# Altium schematic sheet Bier_kuehler.SchDoc: Bierkühler
size A4; Date: <Erstelldatum>; DrawnBy: Nico Herger / Thomas Arnold; Organization: HSLU T&A; Address1: Abteilung Elektrotechnik; Address2: Technikumsstrasse 21; Address3: CH-6048 Horw; Revision: V1.0; SheetNumber: 1; SheetTotal: 1; Projektname: Projekt Bier
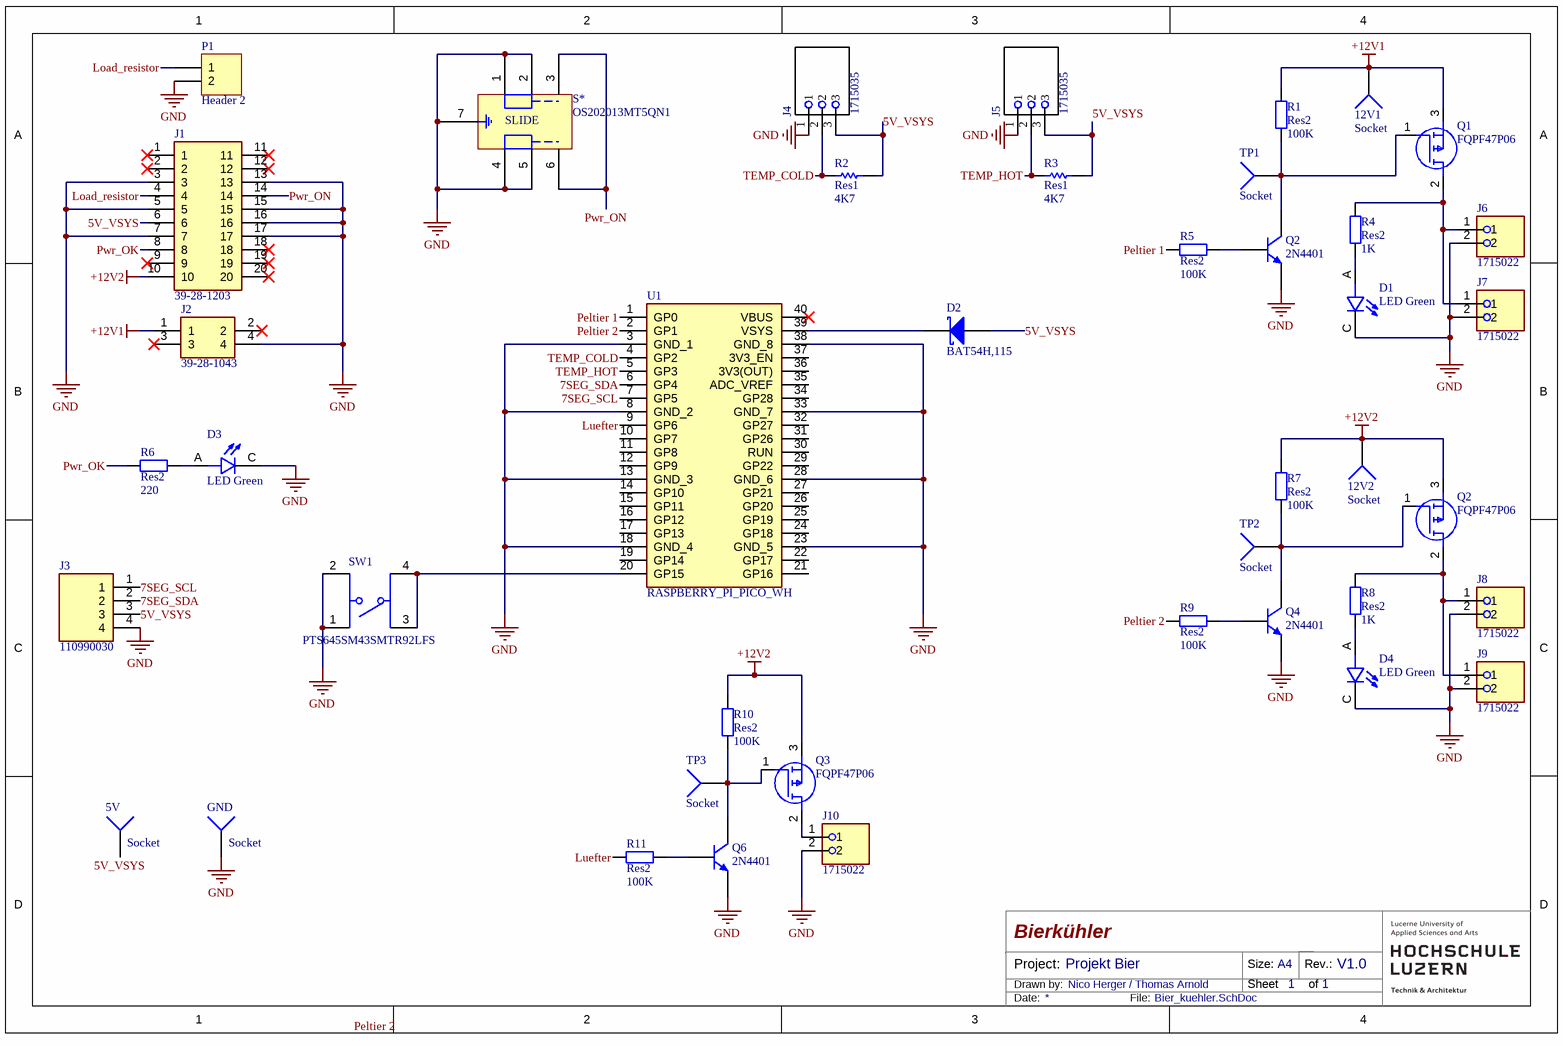
[diagram p0: Bier_kuehler.SchDoc]

## Parts
(Parts that share a designator on the sheet are numbered #1, #2 ... from top to bottom, then left to right.)
5V  Socket  [PIN1]
12V1  Socket  [PIN1]
12V2  Socket  [PIN1]
D1  LED Green  [1411_LED]
D2  BAT54H,115  [SOD-123F]
D3  LED Green  [1411_LED]
D4  LED Green  [1411_LED]
GND  Socket  [PIN1]
J1  39-28-1203  [39-28-1203]
J2  39-28-1043  [39-28-1043]
J3  110990030  [SEEED_110990030]
J4  1715035  [PHOENIX_1715035]
J5  1715035  [PHOENIX_1715035]
J6  1715022  [PHOENIX_1715022]
J7  1715022  [PHOENIX_1715022]
J8  1715022  [PHOENIX_1715022]
J9  1715022  [PHOENIX_1715022]
J10  1715022  [PHOENIX_1715022]
P1  Header 2  [HDR1X2]
Q1  FQPF47P06  [TO254P490X1016X1990-3P]
Q2#1  2N4401  [TO-92A]
Q2#2  FQPF47P06  [TO254P490X1016X1990-3P]
Q3  FQPF47P06  [TO254P490X1016X1990-3P]
Q4  2N4401  [TO-92A]
Q6  2N4401  [TO-92A]
R1  Res2  value 100K  [AXIAL-0.4]
R2  Res1  value 4K7  [AXIAL-0.3]
R3  Res1  value 4K7  [AXIAL-0.3]
R4  Res2  value 1K  [AXIAL-0.4]
R5  Res2  value 100K  [AXIAL-0.4]
R6  Res2  value 220  [AXIAL-0.4]
R7  Res2  value 100K  [AXIAL-0.4]
R8  Res2  value 1K  [AXIAL-0.4]
R9  Res2  value 100K  [AXIAL-0.4]
R10  Res2  value 100K  [AXIAL-0.4]
R11  Res2  value 100K  [AXIAL-0.4]
S*  OS202013MT5QN1  [OS202013MT5QN1]
SW1  PTS645SM43SMTR92LFS  [SWITCH_43SMTR92LFS]
TP1  Socket  [PIN1]
TP2  Socket  [PIN1]
TP3  Socket  [PIN1]
U1  RASPBERRY_PI_PICO_WH  [RASPBERRYPIPICOWH]

## Nets
+12V1: 12V1.1 J2.1 Q1.3(S) R1.2
+12V2: 12V2.1 J1.10 Q2#2.3(S) Q3.3(S) R7.2 R10.2
GND: D1.C D3.C D4.C GND.1 J1.3 J1.5 J1.7 J1.13 J1.15 J1.16 J1.17 J2.4 J3.4 J4.1 J5.1 J6.2 J7.2 J8.2 J9.2 J10.2 P1.2 Q2#1.1(E) Q4.1(E) Q6.1(E) S*.1 S*.2 S*.4 S*.5 S*.7 SW1.1 SW1.2 U1.3(GND_1) U1.8(GND_2) U1.13(GND_3) U1.18(GND_4) U1.23(GND_5) U1.28(GND_6) U1.33(GND_7) U1.38(GND_8)
5V_VSYS: 5V.1 D2.2(A) J1.6 J3.3 J4.3 J5.3 R2.1 R3.1
7SEG_SCL: J3.1 U1.7(GP5)
7SEG_SDA: J3.2 U1.6(GP4)
Load_resistor: J1.4 P1.1
Luefter: R11.1 U1.9(GP6)
Peltier 1: R5.2 U1.1(GP0)
Peltier 2: R9.2 U1.2(GP1)
Pwr_OK: J1.8 R6.1
Pwr_ON: J1.14 S*.3 S*.6
TEMP_COLD: J4.2 R2.2 U1.4(GP2)
TEMP_HOT: J5.2 R3.2 U1.5(GP3)
NetD1_A: D1.A R4.1
NetD2_1: D2.1(K) U1.39(VSYS)
NetD3_A: D3.A R6.2
NetD4_A: D4.A R8.1
NetJ6_1: J6.1 J7.1 Q1.2(D) R4.2
NetJ8_1: J8.1 J9.1 Q2#2.2(D) R8.2
NetJ10_1: J10.1 Q3.2(D)
NetQ1_1: Q1.1(G) Q2#1.3(C) R1.1 TP1.1
NetQ2#1_2: Q2#1.2(B) R5.1
NetQ2#2_1: Q2#2.1(G) Q4.3(C) R7.1 TP2.1
NetQ3_1: Q3.1(G) Q6.3(C) R10.1 TP3.1
NetQ4_2: Q4.2(B) R9.1
NetQ6_2: Q6.2(B) R11.2
NetSW1_3: SW1.3 SW1.4 U1.20(GP15)

Not connected (* = marked no-connect by the designer): J1 1* 2* 9* 11* 12* 18* 19* 20*; J2 2* 3*; U1 10(GP7) 11(GP8) 12(GP9) 14(GP10) 15(GP11) 16(GP12) 17(GP13) 19(GP14) 21(GP16) 22(GP17) 24(GP18) 25(GP19) 26(GP20) 27(GP21) 29(GP22) 30(RUN) 31(GP26) 32(GP27) 34(GP28) 35(ADC_VREF) 36(3V3(OUT)) 37(3V3_EN) 40(VBUS)*

## Notes on the sheet
- Labels drawn without touching a wire or pin: Peltier 2
- Project:
- Drawn by:
- Size:
- Sheet
- A4
- Rev.:
- of
- Date:
- File:
- (in symbol OS202013MT5QN1) SLIDE

## Library data of the parts
D1 D3 D4 = 150141GS73100: Green 525nm LED Indication - Discrete 3.1V 1411 (3528 Metric); Mouser Part Number: 710-150141GS73100; Datasheet: https://www.mouser.ch/datasheet/2/445/150141GS73100-1715081.pdf
D2 = BAT54H,115: D SCHOTTKY 30V 200MA; Mouser Number: 771-BAT54H-T/R; Datasheet: https://www.mouser.ch/datasheet/2/916/BAT54H-1598132.pdf
J1 = 39-28-1203: Connector; Manufacturer_Name: Molex; Datasheet Link: https://www.molex.com/pdm_docs/sd/039281023_sd.pdf; Height: 12.8mm; Manufacturer_Part_Number: 39-28-1203; Mouser Part Number: 538-39-28-1203; Mouser Price/Stock: https://www.mouser.co.uk/ProductDetail/Molex/39-28-1203?qs=4XSMV6Twtb2DRME9sVHqvA%3D%3D
J2 = 39-28-1043: Connector; Manufacturer_Name: Molex; Datasheet Link: https://www.molex.com/pdm_docs/sd/039281023_sd.pdf; Height: 12.8mm; Manufacturer_Part_Number: 39-28-1043; Mouser Part Number: 538-39-28-1043; Mouser Price/Stock: https://www.mouser.co.uk/ProductDetail/Molex/39-28-1043?qs=LQQHZ4xw2XCMHoV0KRLGhg%3D%3D; Arrow Part Number: 39-28-1043; Arrow Price/Stock: https://www.arrow.com/en/products/39-28-1043/molex?region=nac
J3 = 110990030: GROVE 2MM 4PIN VERT CONN 10PCS; MF: Seeed Technology; Arrow_Electronics-Purchase-URL: https://snapeda.com/shop?store=Arrow+Electronics&id=583576; Availability: Good; Package: None; Price: None; Mouser-Purchase-URL: https://snapeda.com/shop?store=Mouser&id=583576; MP: 110990030; SnapEDA_Link: https://www.snapeda.com/parts/110990030/Seeed%20Technology%20Co.,%20Ltd/view-part/583576/?ref=snap; Value: *
J6-J10 = 1715022: PCB Terminal Screw 5mm 16AWG 400V 17.5A 2 Position COMBICON MKDS Series | Phoenix Contact 1715022; SnapEDA_Link: https://www.snapeda.com/parts/1715022/Phoenix+Contact/view-part/?ref=snap; Package: None; Value: *; MF: Phoenix Contact; MP: 1715022; Check_prices: https://www.snapeda.com/parts/1715022/Phoenix+Contact/view-part/?ref=eda
P1 = Header 2: Header, 2-Pin; LatestRevisionDate: 17-Jul-2002; LatestRevisionNote: Re-released for DXP Platform.; Publisher: Altium Limited
Q1 Q2#2 Q3 = FQPF47P06: MOSFET (P-Channel); Manufacturer_Name: onsemi; Datasheet Link: https://www.onsemi.com/pdf/datasheet/fqpf47p06-d.pdf; Height: 4.9mm; Manufacturer_Part_Number: FQPF47P06; Mouser Part Number: 512-FQPF47P06; Mouser Price/Stock: https://www.mouser.co.uk/ProductDetail/ON-Semiconductor-Fairchild/FQPF47P06/?qs=Ra3DxqLXWjfTqaAPd3%2FiZw%3D%3D; Arrow Part Number: FQPF47P06; Arrow Price/Stock: https://www.arrow.com/en/products/fqpf47p06/on-semiconductor
Q2#1 Q4 Q6 = 2N3904: NPN General Purpose Amplifier; Published: 8-Jun-2000; LatestRevisionDate: 15-Jan-2003; LatestRevisionNote: PCB Footprint 'BCY-W3/D4.7' replaced; DatasheetVersion: 1997; PackageVersion: Sep-1998; PackageReference: TO-92A; Publisher: Altium Limited; PackageDescription: TO, Flat Index; 3 In-Line, Axial Leads; Body Dia. 4.5mm; Leads 0.51 x 0.48 mm (max); ComponentLink1Description: Manufacturer Link; ComponentLink1URL: http://www.fairchildsemi.com/; ComponentLink2Description: Datasheet; ComponentLink2URL: http://www.fairchildsemi.com/ds/2N%2F2N3904.pdf
R1 R4-R11 = Res2: Resistor; Published: 8-Jun-2000; LatestRevisionDate: 17-Jul-2002; LatestRevisionNote: Re-released for DXP Platform.; PackageReference: AXIAL-0.4; Publisher: Altium Limited; PackageDescription: Axial Device, Thru-Hole; 2 Leads; 0.4 in Pin Spacing
R2 R3 = Res1: Resistor; Published: 8-Jun-2000; LatestRevisionDate: 17-Jul-2002; LatestRevisionNote: Re-released for DXP Platform.; PackageReference: AXIAL-0.3; Publisher: Altium Limited; PackageDescription: Axial Device, Thru-Hole; 2 Leads; 0.3 in Pin Spacing
S* = OS202013MT5QN1: Slide Switch
SW1 = PTS645SM43SMTR92LFS: Tactile Switch Normally Open; Datasheet: https://www.mouser.ch/datasheet/2/60/pts645-1841767.pdf; Mouser Part Number: 611-PTS645SM43SMTR92
U1 = RASPBERRY_PI_PICO_WH: Undefined or Miscellaneous; Manufacturer_Name: RASPBERRY-PI; Manufacturer_Part_Number: RASPBERRY PI PICO WH; Datasheet Link: https://datasheets.raspberrypi.com/picow/pico-w-datasheet.pdf; Height: 4mm
5V 12V1 12V2 GND TP1-TP3 = Socket: LatestRevisionDate: 17-Jul-2002; LatestRevisionNote: Re-released for DXP Platform.; Publisher: Altium Limited
J4 J5 = 1715035: SnapEDA_Link: https://www.snapeda.com/parts/1715035/Phoenix+Contact/view-part/?ref=snap; Check_prices: https://www.snapeda.com/parts/1715035/Phoenix+Contact/view-part/?ref=eda; Value: *